# Altium schematic sheet IsolatedDAC.SchDoc
size A4
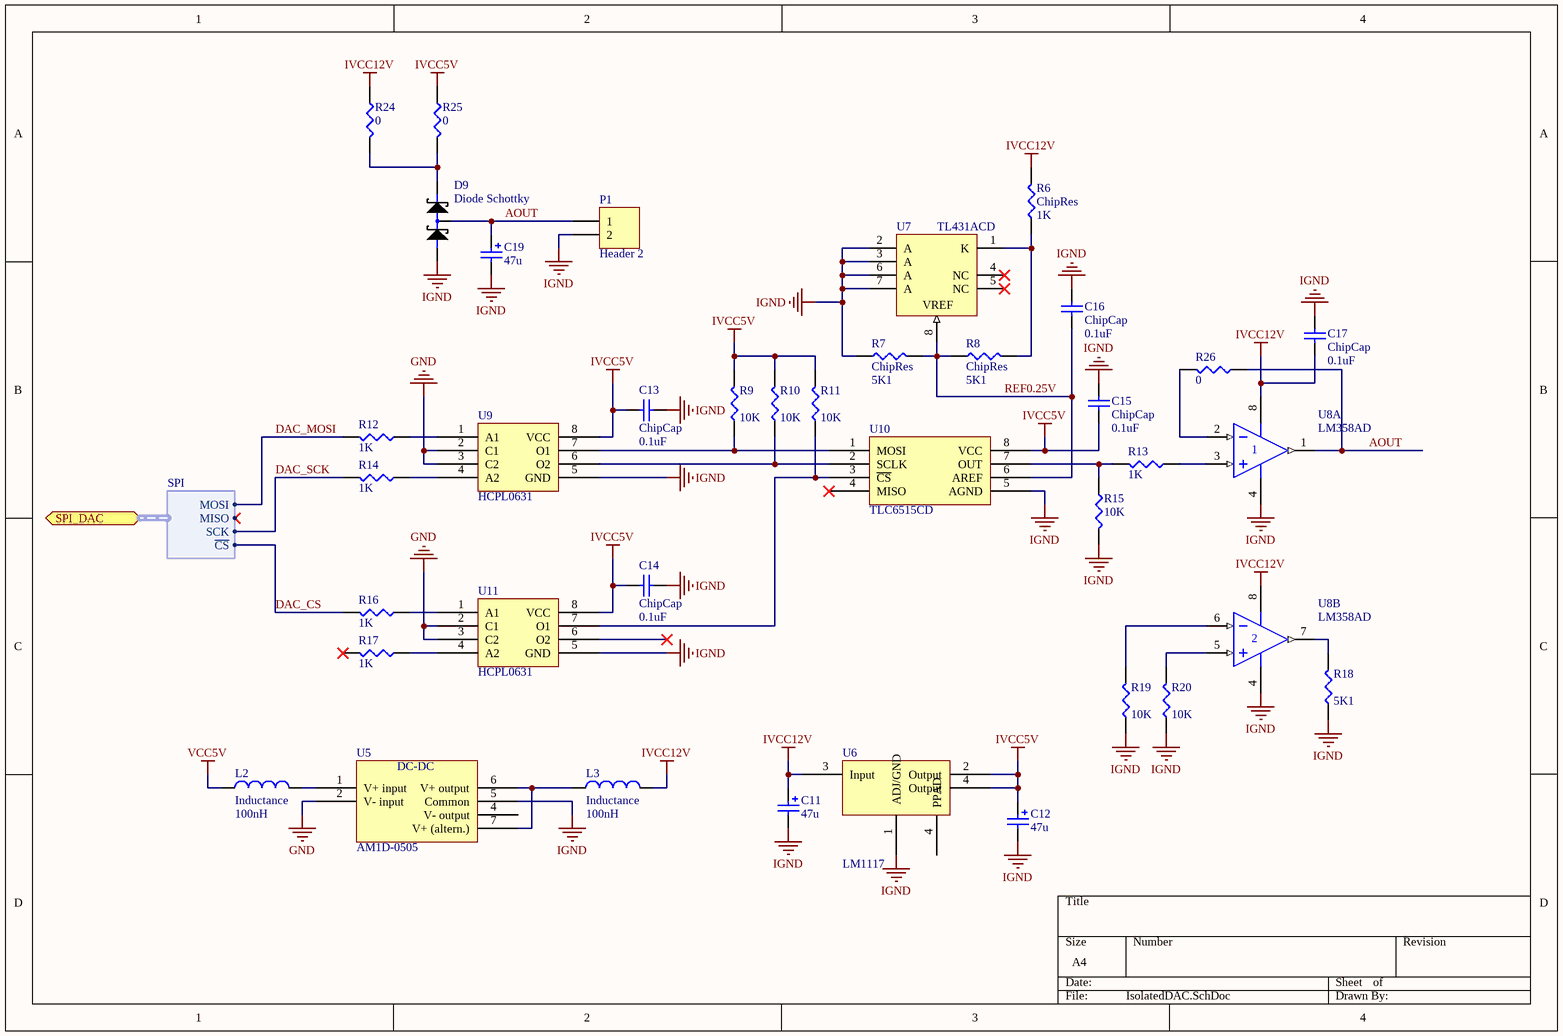
[diagram p0: IsolatedDAC.SchDoc]

## Parts
C11  value 47u  [CAPC7343]  (hidden comment: Cap Pol SMD)
C12  value 47u  [CAPC7343]  (hidden comment: Cap Pol SMD)
C13  ChipCap  value 0.1uF  [CAP0805]
C14  ChipCap  value 0.1uF  [CAP0805]
C15  ChipCap  value 0.1uF  [CAP0805]
C16  ChipCap  value 0.1uF  [CAP0805]
C17  ChipCap  value 0.1uF  [CAP0805]
C19  value 47u  [CAPC7343]  (hidden comment: Cap Pol SMD)
D9  Diode Schottky  [SOT23]
L2  Inductance  value 100nH  [CM32]
L3  Inductance  value 100nH  [CM32]
P1  Header 2  [HDR1X2]
R6  ChipRes  value 1K  [RES0805]
R7  ChipRes  value 5K1  [RES0805]
R8  ChipRes  value 5K1  [RES0805]
R9  value 10K  [RES0805]  (hidden comment: ChipRes)
R10  value 10K  [RES0805]  (hidden comment: ChipRes)
R11  value 10K  [RES0805]  (hidden comment: ChipRes)
R12  value 1K  [RES0805]  (hidden comment: ChipRes)
R13  value 1K  [RES0805]  (hidden comment: ChipRes)
R14  value 1K  [RES0805]  (hidden comment: ChipRes)
R15  value 10K  [RES0805]  (hidden comment: ChipRes)
R16  value 1K  [RES0805]  (hidden comment: ChipRes)
R17  value 1K  [RES0805]  (hidden comment: ChipRes)
R18  value 5K1  [RES0805]  (hidden comment: ChipRes)
R19  value 10K  [RES0805]  (hidden comment: ChipRes)
R20  value 10K  [RES0805]  (hidden comment: ChipRes)
R24  value 0  [RES0805]  (hidden comment: ChipRes)
R25  value 0  [RES0805]  (hidden comment: ChipRes)
R26  value 0  [RES0805]  (hidden comment: ChipRes)
U5  AM1D-0505  [SIP14]
U6  LM1117  [SOT223-4M]
U7  TL431ACD  [D008_N]
U8  LM358AD  [D008_L]  (parts A,B of 2)
U9  HCPL0631  [SOIC8]
U10  TLC6515CD  [SOIC8]
U11  HCPL0631  [SOIC8]

## Ports
SPI_DAC (harness SPI)

## Harnesses
SPI: MOSI, MISO, SCK, ~{CS}

## Nets
GND: U5.2(V-_input) U9.2(C1) U9.3(C2) U11.2(C1) U11.3(C2)
IGND: C11.2 C12.2 C13.1 C14.1 C15.1 C16.1 C17.1 C19.2 D9.1 P1.2 R7.1 R15.2 R18.1 R19.1 R20.1 U5.5(Common) U6.1(ADJ/GND) U7.2(A) U7.3(A) U7.6(A) U7.7(A) U8.4(V-) U9.5(GND) U10.5(AGND) U11.5(GND)
IVCC5V: C12.1 C13.2 C14.2 C15.2 R9.2 R10.2 R11.2 R25.1 U6.2(Output) U6.4(PPAD) U9.8(VCC) U10.8(VCC) U11.8(VCC)
IVCC12V: C11.1 C17.2 L3.1 R6.2 R24.1 U6.3(Input) U8.8(V+)
VCC5V: L2.2
AOUT: C19.1 D9.3 P1.1 R26.1 U8.1(OUT)
DAC_CS: R16.2 ; port SPI_DAC.~{CS}
DAC_MOSI: R12.2 ; port SPI_DAC.MOSI
DAC_SCK: R14.2 ; port SPI_DAC.SCK
REF0.25V: C16.2 R7.2 R8.1 U7.8(VREF) U10.6(AREF)
NetD9_2: D9.2 R24.2 R25.2
NetL2_1: L2.1 U5.1(V+_input)
NetL3_2: L3.2 U5.6(V+_output) U5.7(V+_(altern.))
NetR6_1: R6.1 R8.2 U7.1(K)
NetR9_1: R9.1 U9.7(O1) U10.1(MOSI)
NetR10_1: R10.1 U9.6(O2) U10.2(SCLK)
NetR11_1: R11.1 U10.3(~{CS}) U11.7(O1)
NetR12_1: R12.1 U9.1(A1)
NetR13_1: R13.1 U8.3(IN+)
NetR13_2: R13.2 R15.1 U10.7(OUT)
NetR14_1: R14.1 U9.4(A2)
NetR16_1: R16.1 U11.1(A1)
NetR17_1: R17.1 U11.4(A2)
NetR18_2: R18.2 U8.7(OUT)
NetR19_2: R19.2 U8.6(IN-)
NetR20_2: R20.2 U8.5(IN+)
NetR26_2: R26.2 U8.2(IN-)

Not connected (* = marked no-connect by the designer): R17 2*; U5 4(V-_output); U7 4(NC)* 5(NC)*; U10 4(MISO)*; U11 6(O2)*

## Notes on the sheet
- (in symbol AM1D-0512) DC-DC

## Library data of the parts
C11 C12 C19 = Cap Pol Chip: Polarized Capacitor (Radial); Supplier 1: Digi-Key; Supplier Part Number 1: 399-4029-1-ND
C13-C17 = ChipCap: Capacitor; Published: 8-Jun-2000; LatestRevisionDate: 17-Jul-2002; LatestRevisionNote: Re-released for DXP Platform.; PackageReference: RAD-0.3; Publisher: Altium Limited
D9 = Schottky Diode: 2-Diode Schottky
L2 L3 = ChipInductance
P1 = Header 2: Header, 2-Pin; LatestRevisionDate: 17-Jul-2002; LatestRevisionNote: Re-released for DXP Platform.; Publisher: Altium Limited
R6-R20 R24-R26 = ChipRes: Chip resistor
U5 = AM1D-0512: DC-DC 5-12V convertor
U6 = LM1117: Power Mgt Voltage Regulator
U7 = TL431ACD: Adjustable Precision Shunt Regulator; Published: 15-Apr-2002; LatestRevisionDate: 13-Apr-2006; LatestRevisionNote: IPC-7351 Footprint Added.; DatasheetVersion: Oct-2000; PackageVersion: Jan-1998; PackageReference: D008; Publisher: Altium Limited; PackageDescription: 8-Pin Small Outline Integrated Circuit 1.27 mm Pitch; Code_IPC: SOIC127P600-8; ComponentLink1Description: Manufacturer Link; ComponentLink1URL: http://www.ti.com/; ComponentLink2Description: Datasheet; ComponentLink2URL: http://www-s.ti.com/sc/ds/tl431a.pdf
U8 = LM358AD: Dual Operational Amplifier; Published: 15-Apr-2002; LatestRevisionDate: 13-Apr-2006; LatestRevisionNote: IPC-7351 Footprint Added.; DatasheetVersion: Aug-1988; PackageVersion: Jan-1998; PackageReference: D008; Publisher: Altium Limited; PackageDescription: 8-Pin Small Outline Integrated Circuit 1.27 mm Pitch; Code_IPC: SOIC127P600-8; ComponentLink1Description: Manufacturer Link; ComponentLink1URL: http://www.ti.com/; ComponentLink2Description: Datasheet; ComponentLink2URL: http://www-s.ti.com/sc/ds/lm358.pdf
U9 U11 = HCPL0631: 2-channel opto-coupler
U10 = TLC6515: 10-bit analog to digiyal converter; Manufacturer: Texas Instruments